# EAGLE design Weapon_Box (EAGLE 7.7.0)
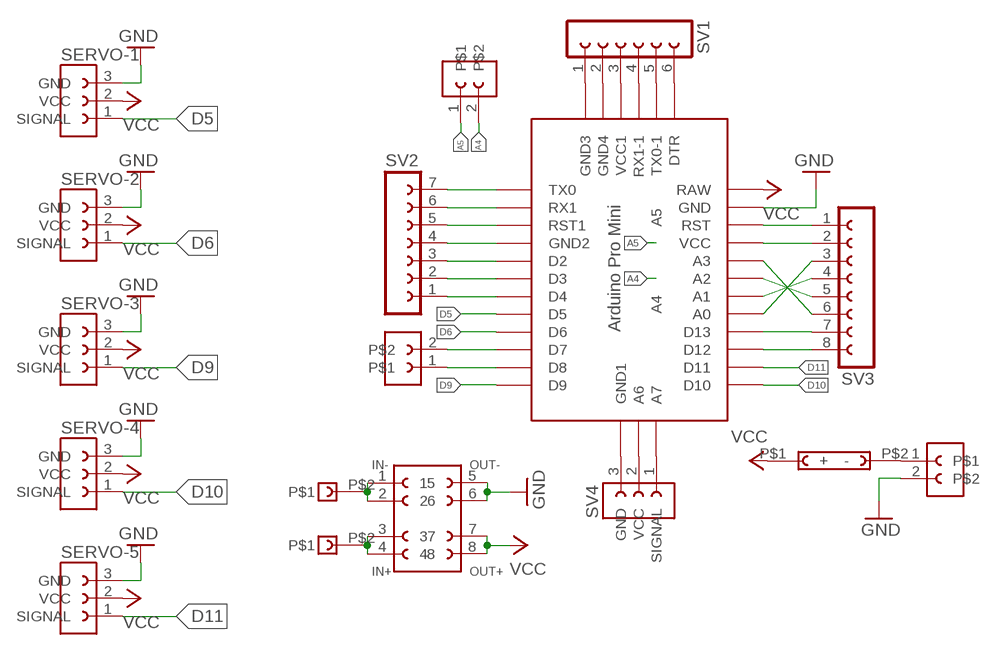
[diagram p0: schematic, sheet 1]

## Parts
SERVO-1  FE05-1  [FE05-1]
SERVO-2  FE05-1  [FE05-1]
SERVO-3  FE05-1  [FE05-1]
SERVO-4  FE05-1  [FE05-1]
SERVO-5  FE05-1  [FE05-1]
SV1  FE06-1  [FE06]
SV2  FE07-1  [FE07]
SV3  FE08-1  [FE08]
SV4  FE05-1  [FE05-1]
U$1  ABK-PRO-MINI  [ABK-PRO-MINI]
U$2  ROWER_SUPPLY  [ROWER_SUPPLY]
U$3  FE02  [FE02]
U$4  2018  [2018]
U$5  2018  [2018]
U$6  330  [330]
U$7  FE02  [FE02]
U$8  FE02  [FE02]

## Nets
A4: U$1.A4 U$8.2
A5: U$1.A5 U$8.1
D5: SERVO-1.1(SIGNAL) U$1.D5
D6: SERVO-2.1(SIGNAL) U$1.D6
D9: SERVO-3.1(SIGNAL) U$1.D9
D10: SERVO-4.1(SIGNAL) U$1.D10
D11: SERVO-5.1(SIGNAL) U$1.D11
GND: SERVO-1.3(GND) SERVO-2.3(GND) SERVO-3.3(GND) SERVO-4.3(GND) SERVO-5.3(GND) U$1.GND U$2.5 U$2.6 U$7.2
N$1: SV1.1 U$1.GND2(GND3)
N$2: SV1.2 U$1.GND3(GND4)
N$3: SV1.3 U$1.VCC1
N$4: SV1.4 U$1.RX1-1
N$5: SV1.5 U$1.TX0-1
N$6: SV1.6 U$1.DTR
N$7: SV2.1 U$1.D4
N$8: SV2.2 U$1.D3
N$9: SV2.3 U$1.D2
N$10: SV2.4 U$1.GND1(GND2)
N$11: SV2.5 U$1.RST1
N$12: SV2.6 U$1.RX1
N$13: SV2.7 U$1.TX0
N$14: SV3.6 U$1.A3
N$15: SV3.3 U$1.A0
N$16: SV3.5 U$1.A2
N$17: SV3.4 U$1.A1
N$18: SV3.1 U$1.RST
N$19: SV3.2 U$1.VCC
N$20: SV3.7 U$1.D13
N$21: SV3.8 U$1.D12
N$22: SV4.1(SIGNAL) U$1.A7
N$23: SV4.2(VCC) U$1.A6
N$24: SV4.3(GND) U$1.GND4(GND1)
N$25: U$1.D8 U$3.1
N$26: U$1.D7 U$3.2
N$27: U$2.3 U$2.4 U$5.P$2
N$28: U$6.P$2(-) U$7.1
N$30: U$2.1 U$2.2 U$4.P$2
VCC: SERVO-1.2(VCC) SERVO-2.2(VCC) SERVO-3.2(VCC) SERVO-4.2(VCC) SERVO-5.2(VCC) U$1.RAW U$2.7 U$2.8 U$6.P$1(+)

## Library data of the parts
SERVO-1-SERVO-5 SV4 = con-lsta:FE05-1: FEMALE HEADER; OC_FARNELL: unknown; OC_NEWARK: unknown
SV1 = con-lsta:FE06-1: FEMALE HEADER; OC_FARNELL: unknown; OC_NEWARK: unknown
SV2 = con-lsta:FE07-1: FEMALE HEADER; OC_FARNELL: unknown; OC_NEWARK: unknown
SV3 = con-lsta:FE08-1: FEMALE HEADER; OC_FARNELL: unknown; OC_NEWARK: unknown
U$1 = Arduino-clone:ABK-PRO-MINI: ABK Pro-Mini Arduino Clone
U$2 = Power Supply:ROWER_SUPPLY
U$3 U$7 U$8 = con-lsta:FE02
U$4 U$5 = 2018:2018
U$6 = 330:330

## Board
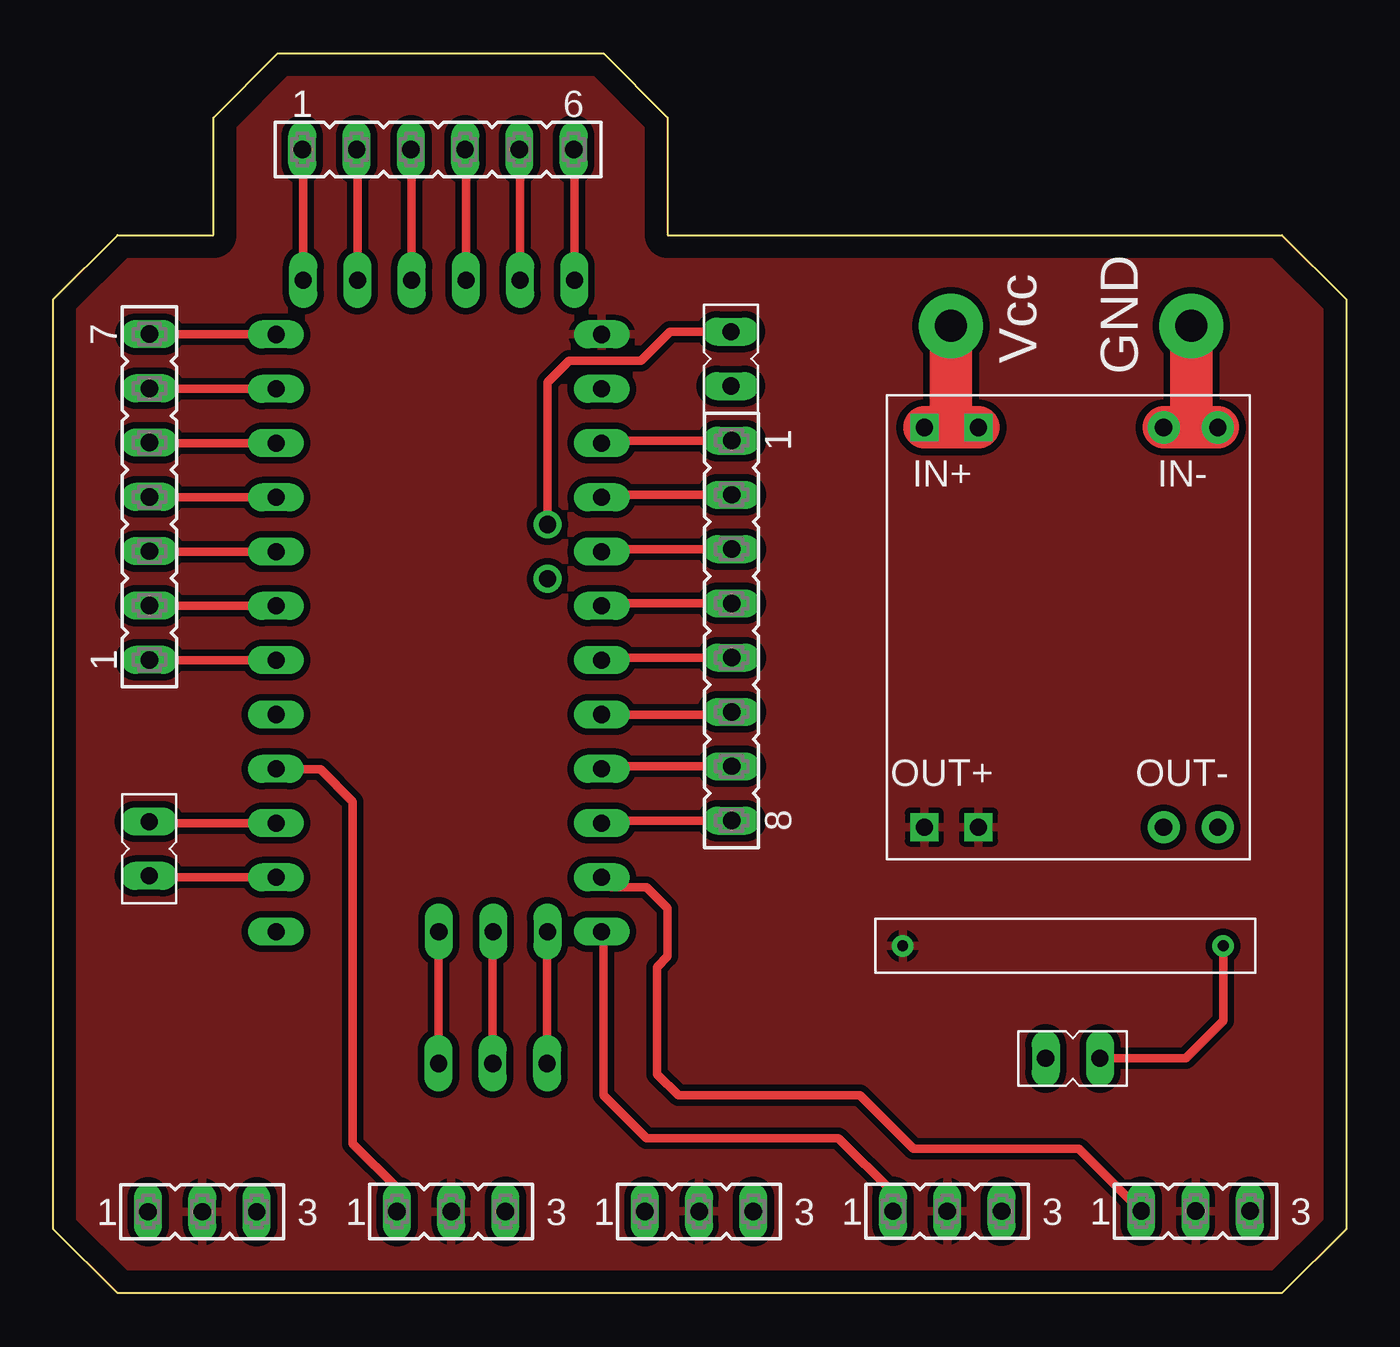
[diagram p1: board, top side]
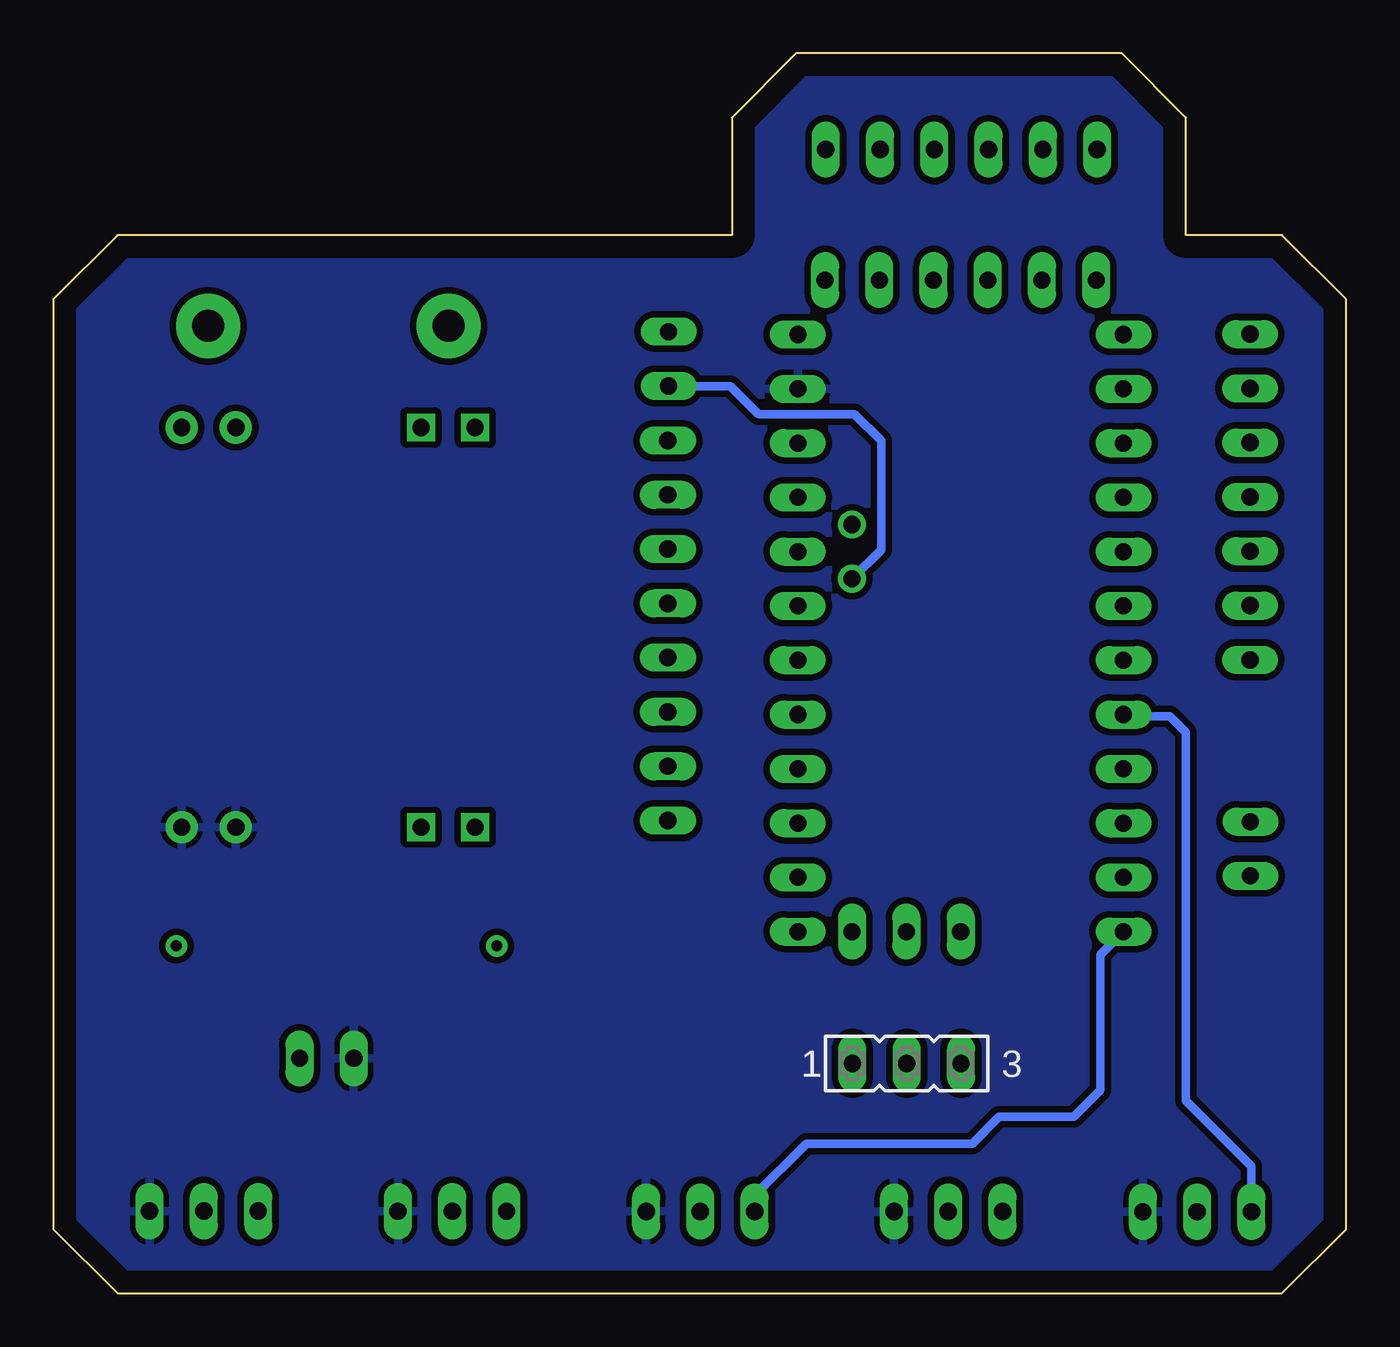
[diagram p2: board, bottom side, seen from below]

Size 60.5 x 58 mm. Coordinates in mm from the lower left corner, seen from the top.
Outline: 0,3 0,46.5 3,49.5 7.5,49.5 7.5,55 10.5,58 25.75,58 28.75,55 28.75,49.5 57.5,49.5 60.5,46.5 60.5,3 57.5,0 3,0 0,3
Copper layers (1*16): Top 0.035mm / dielectric 1.5mm / Bottom 0.035mm
Design rules "default *": minimum track width 10mil, minimum drill 24mil, track to track 12mil, track to pad 12mil, pad to pad 8mil, via to via 8mil, smd to smd 8mil, copper to edge 40mil, drill to drill 8mil, minimum pad ring 10mil, minimum via ring 8mil, stop-mask expansion 4mil, vias tented up to drill 0mil, thermal gap 10mil

### Footprints (pad centres in the part's own frame; a part is rotated, then mirrored left to right if it is on the bottom)
FE05-1 = drill 0.813 long: 1 -5.08,0; 2 -2.54,0; 3 0,0
FE06 = drill 0.813 long: 1 -6.35,0; 2 -3.81,0; 3 -1.27,0; 4 1.27,0; 5 3.81,0; 6 6.35,0
FE07 = drill 0.813 long: 1 -7.62,0; 2 -5.08,0; 3 -2.54,0; 4 0,0; 5 2.54,0; 6 5.08,0; 7 7.62,0
FE08 = drill 0.813 long: 1 -8.89,0; 2 -6.35,0; 3 -3.81,0; 4 -1.27,0; 5 1.27,0; 6 3.81,0; 7 6.35,0; 8 8.89,0
ABK-PRO-MINI = drill 0.8 long: A0 10.16,-3.81; A1 10.16,-6.35; A2 10.16,-8.89; A3 10.16,-11.43; A6 5.08,-21.59; A7 7.62,-21.59; D2 -5.08,-3.81; D3 -5.08,-6.35; D4 -5.08,-8.89; D5 -5.08,-11.43; D6 -5.08,-13.97; D7 -5.08,-16.51; D8 -5.08,-19.05; D9 -5.08,-21.59; D10 10.16,-21.59; D11 10.16,-19.05; D12 10.16,-16.51; D13 10.16,-13.97; DTR 8.89,8.89; GND 10.16,3.81; GND1 -5.08,-1.27; GND2 -3.81,8.89; GND3 -1.27,8.89; GND4 2.54,-21.59; RAW 10.16,6.35; RST 10.16,1.27; RST1 -5.08,1.27; RX1 -5.08,3.81; RX1-1 3.81,8.89; TX0 -5.08,6.35; TX0-1 6.35,8.89; VCC 10.16,-1.27; VCC1 1.27,8.89 | drill 0.8: A4 7.62,-5.08; A5 7.62,-2.54
ROWER_SUPPLY = drill 0.8 pad 1.5: 1 1.5,1.5; 2 4.04,1.5; 5 1.5,20.2; 6 4.04,20.2 | drill 0.8 square: 3 12.7,1.5; 4 15.24,1.5; 7 12.7,20.2; 8 15.24,20.2
FE02 = drill 0.8 long: 1 1.27,1.27; 2 3.81,1.27
2018 = drill 1.5 pad 3: P$2 0,0
330 = drill 0.5: P$1 0,0; P$2 15,0

### Placement (x,y rotation side)
SERVO-1  9.51,3.81 0 top
SERVO-2  21.16,3.82 0 top
SERVO-3  32.76,3.82 0 top
SERVO-4  44.37,3.83 0 top
SERVO-5  56,3.84 0 top
SV1  18,53.5 0 top
SV2  4.5,37.25 90 top
SV3  31.74,31 270 top
SV4  18.02,10.75 0 bottom
U$1  15.5,38.5 0 top
U$2  56,42 180 top
U$3  5.75,18.25 90 top
U$4  53.25,45.25 0 top
U$5  42,45.25 0 top
U$6  39.75,16.25 0 top
U$7  50.25,12.25 180 top
U$8  30.44,46.25 270 top

### Tracks (layer width: path | path; a pad name or v marks a point on that pad's centre or on a via)
A4
  Bottom 0.4: U$8.2 28.82,42.44 27.5,41.12 23,41.12 21.75,39.88 21.75,34.79 U$1.A4
A5
  Top 0.4: U$8.1 28.86,44.98 27.5,43.62 24.12,43.62 23.12,42.62 U$1.A5
D5
  Bottom 0.4: U$1.D5 10.35,27 8.25,27 7.5,26.25 7.5,9 4.43,5.93 SERVO-1.1
D6
  Top 0.4: U$1.D6 10.45,24.5 12.5,24.5 14,23 14,7 16.08,4.92 SERVO-2.1
D9
  Bottom 0.4: U$1.D9 11.5,15.83 11.5,9.5 12.75,8.25 16.25,8.25 17.5,7 25.25,7 27.68,4.57 SERVO-3.1
D10
  Top 0.4: U$1.D10 25.75,16.82 25.75,9.25 27.75,7.25 36.75,7.25 39.29,4.71 SERVO-4.1
D11
  Top 0.4: U$1.D11 26.11,19 27.75,19 28.75,18 28.75,15.75 28.25,15.25 28.25,10.25 29.25,9.25 37.75,9.25 40.25,6.75 48,6.75 SERVO-5.1
GND
  pour Bottom: 0,3 0,46.5 3,49.5 7.5,49.5 7.5,55 10.5,58 25.75,58 28.75,55 28.75,49.5 57.5,49.5 60.5,46.5 60.5,3 57.5,0 3,0
N$1
  Top 0.4: SV1.1 11.69,53.46 U$1.GND2
N$2
  Top 0.4: SV1.2 14.23,53.46 U$1.GND3
N$3
  Top 0.4: SV1.3 16.77,53.46 U$1.VCC1
N$4
  Top 0.4: SV1.4 19.31,53.46 U$1.RX1-1
N$5
  Top 0.4: SV1.5 21.85,53.46 U$1.TX0-1
N$6
  Top 0.4: SV1.6 24.39,53.46 U$1.DTR
N$7
  Top 0.4: SV2.1 4.52,29.61 U$1.D4
N$8
  Top 0.4: SV2.2 4.52,32.15 U$1.D3
N$9
  Top 0.4: SV2.3 4.52,34.69 U$1.D2
N$10
  Top 0.4: SV2.4 4.52,37.23 U$1.GND1
N$11
  Top 0.4: SV2.5 4.52,39.77 U$1.RST1
N$12
  Top 0.4: SV2.6 4.52,42.31 U$1.RX1
N$13
  Top 0.4: SV2.7 4.52,44.85 U$1.TX0
N$14
  Top 0.4: SV3.6 31.62,27.07 U$1.A3
N$15
  Top 0.4: U$1.A0 25.78,34.81 SV3.3
N$16
  Top 0.4: U$1.A2 25.78,29.73 SV3.5
N$17
  Top 0.4: U$1.A1 25.78,32.27 SV3.4
N$18
  Top 0.4: U$1.RST 25.78,39.89 SV3.1
N$19
  Top 0.4: U$1.VCC 25.78,37.35 SV3.2
N$20
  Top 0.4: U$1.D13 25.78,24.65 SV3.7
N$21
  Top 0.4: U$1.D12 25.78,22.11 SV3.8
N$22
  Top 0.4: U$1.A7 23.11,16.9 SV4.1
N$23
  Top 0.4: U$1.A6 20.57,16.9 SV4.2
N$24
  Top 0.4: U$1.GND4 18.02,16.9 SV4.3
N$25
  Top 0.4: U$3.1 4.55,19.45 U$1.D8
N$26
  Top 0.4: U$3.2 4.55,21.99 U$1.D7
N$27
  Top 2: U$2.4 42,40.5 | 42,40.5 U$2.3 | U$5.P$2 42,40.5
N$28
  Top 0.4: U$6.P$2 54.75,12.75 53,11 49,11 U$7.1
N$30
  Top 2: U$2.2 53.25,40.5 | 53.25,40.5 U$2.1 | U$4.P$2 53.25,40.5
VCC
  pour Top: 3,0 0,3 0,46.5 3,49.5 7.5,49.5 7.5,55 10.5,58 25.75,58 28.75,55 28.75,49.5 57.5,49.5 60.5,46.5 60.5,3 57.5,0

### Text on the board
tPlace: Vcc | GND